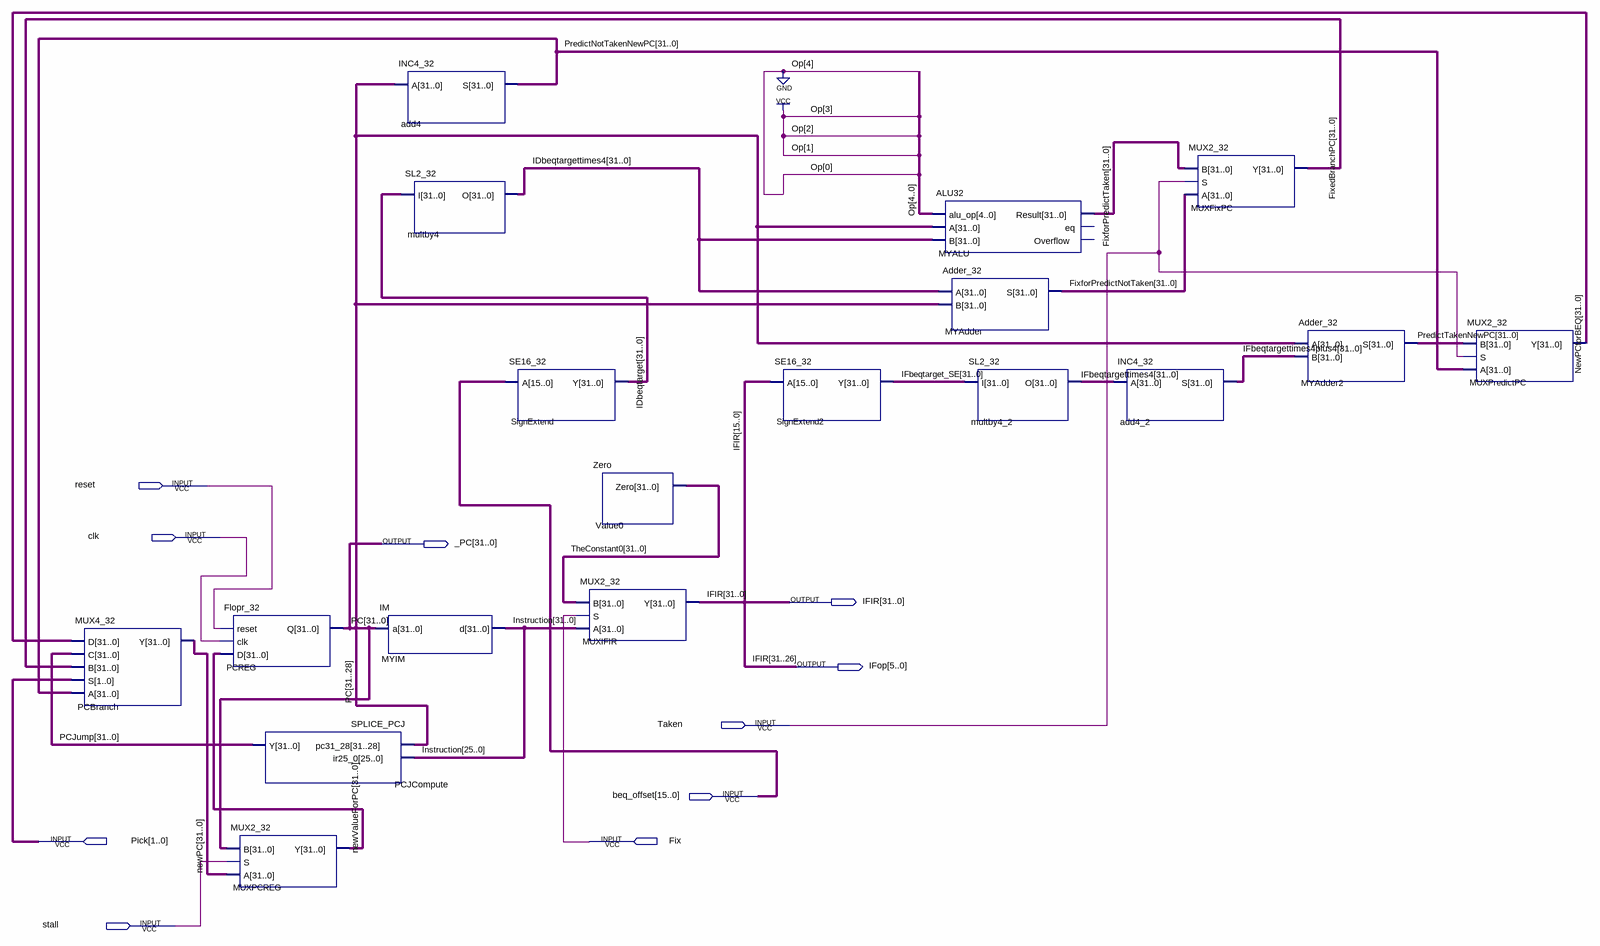
[diagram p0: schematic sheet]
// Quartus schematic IFF.bdf as structural Verilog: 18 symbols, 10 pins
module IFF (
  input  reset,
  input  clk,
  input  Taken,
  input  [15:0] beq_offset,
  input  [1:0] Pick,
  input  Fix,
  input  stall,
  output [31:0] _PC,
  output [31:0] IFIR,
  output [5:0] IFop
);

  wire [31:0] FixedBranchPC, FixforPredictNotTaken, FixforPredictTaken, IDbeqtarget, IDbeqtargettimes4,
       IFbeqtarget_SE, IFbeqtargettimes4, IFbeqtargettimes4plus4, Instruction, newPC, NewPCforBEQ,
       newValueForPC, PCJump, PredictNotTakenNewPC, PredictTakenNewPC, TheConstant0;

  MUX4_32 PCBranch (.D(NewPCforBEQ), .C(PCJump), .B(FixedBranchPC), .S(Pick), .A(PredictNotTakenNewPC), .Y(newPC));
  Flopr_32 PCREG (.reset(reset), .clk(clk), .D(newValueForPC), .Q(_PC));
  MUX2_32 MUXPCREG (.B(_PC), .S(stall), .A(newPC), .Y(newValueForPC));
  SPLICE_PCJ PCJCompute (.pc31_28(_PC[31:28]), .ir25_0(Instruction[25:0]), .Y(PCJump));
  IM MYIM (.a(_PC), .d(Instruction));
  INC4_32 add4 (.A(_PC), .S(PredictNotTakenNewPC));
  SL2_32 multby4 (.I(IDbeqtarget), .O(IDbeqtargettimes4));
  SE16_32 SignExtend (.A(beq_offset), .Y(IDbeqtarget));
  Zero Value0 (.Zero(TheConstant0));
  MUX2_32 MUXIFIR (.B(TheConstant0), .S(Fix), .A(Instruction), .Y(IFIR));
  SE16_32 SignExtend2 (.A(IFIR[15:0]), .Y(IFbeqtarget_SE));
  ALU32 MYALU (.alu_op(5'b01110), .A(_PC), .B(IDbeqtargettimes4), .Result(FixforPredictTaken));  // open: eq, Overflow
  Adder_32 MYAdder (.A(IDbeqtargettimes4), .B(_PC), .S(FixforPredictNotTaken));
  SL2_32 multby4_2 (.I(IFbeqtarget_SE), .O(IFbeqtargettimes4));
  INC4_32 add4_2 (.A(IFbeqtargettimes4), .S(IFbeqtargettimes4plus4));
  MUX2_32 MUXFixPC (.B(FixforPredictTaken), .S(Taken), .A(FixforPredictNotTaken), .Y(FixedBranchPC));
  Adder_32 MYAdder2 (.A(_PC), .B(IFbeqtargettimes4plus4), .S(PredictTakenNewPC));
  MUX2_32 MUXPredictPC (.B(PredictTakenNewPC), .S(Taken), .A(PredictNotTakenNewPC), .Y(NewPCforBEQ));

  assign IFop = IFIR[31:26];

  // Other names for the same wires on the sheet: PC[31:0] = _PC
endmodule
